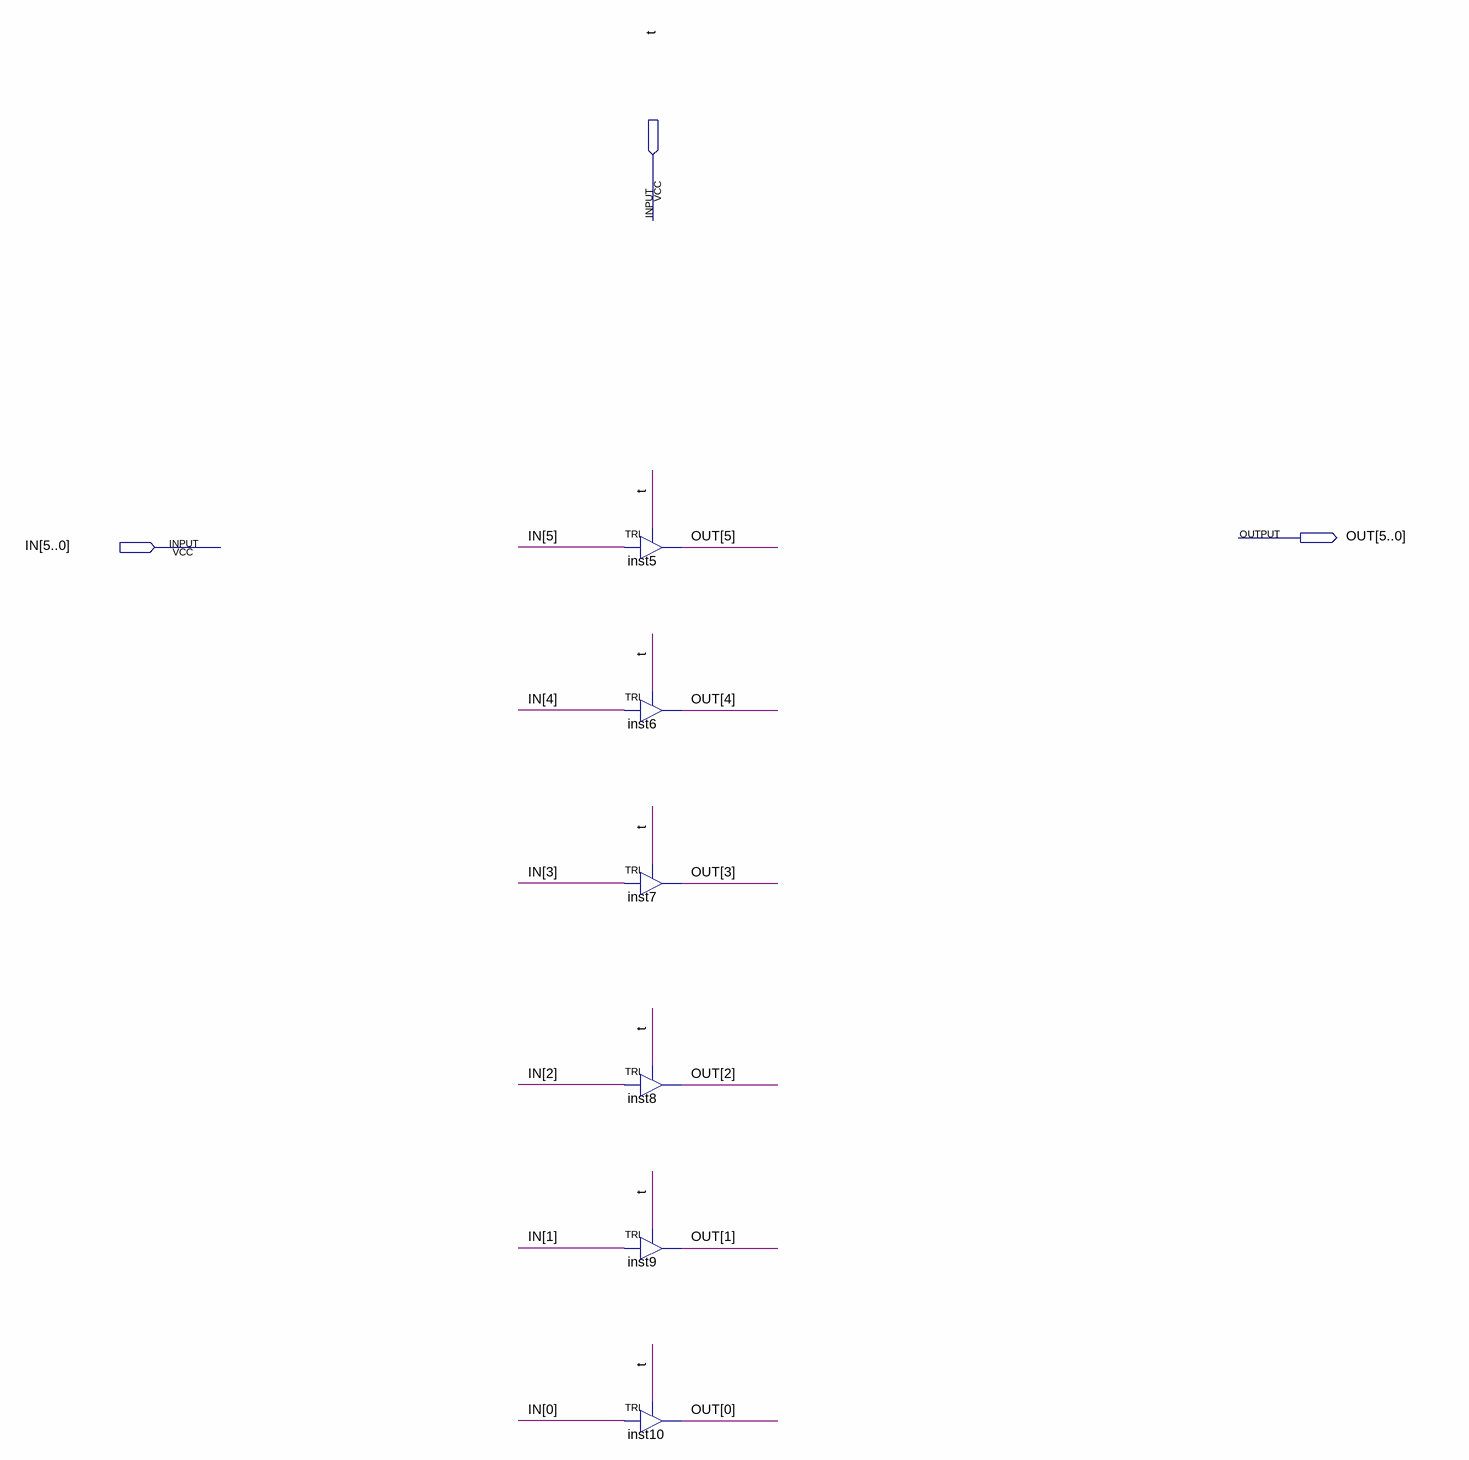
[diagram p0: schematic sheet]
// Quartus schematic triBus_6bit.bdf as structural Verilog: 6 symbols, 3 pins
module triBus_6bit (
  input  t,
  input  [5:0] IN,
  output [5:0] OUT
);

  TRI inst5 (.IN(IN[5]), .OE(t), .OUT(OUT[5]));
  TRI inst6 (.IN(IN[4]), .OE(t), .OUT(OUT[4]));
  TRI inst7 (.IN(IN[3]), .OE(t), .OUT(OUT[3]));
  TRI inst8 (.IN(IN[2]), .OE(t), .OUT(OUT[2]));
  TRI inst9 (.IN(IN[1]), .OE(t), .OUT(OUT[1]));
  TRI inst10 (.IN(IN[0]), .OE(t), .OUT(OUT[0]));
endmodule
